# EAGLE design wing-driver (EAGLE 5.04)

## Sheet 1 of 2
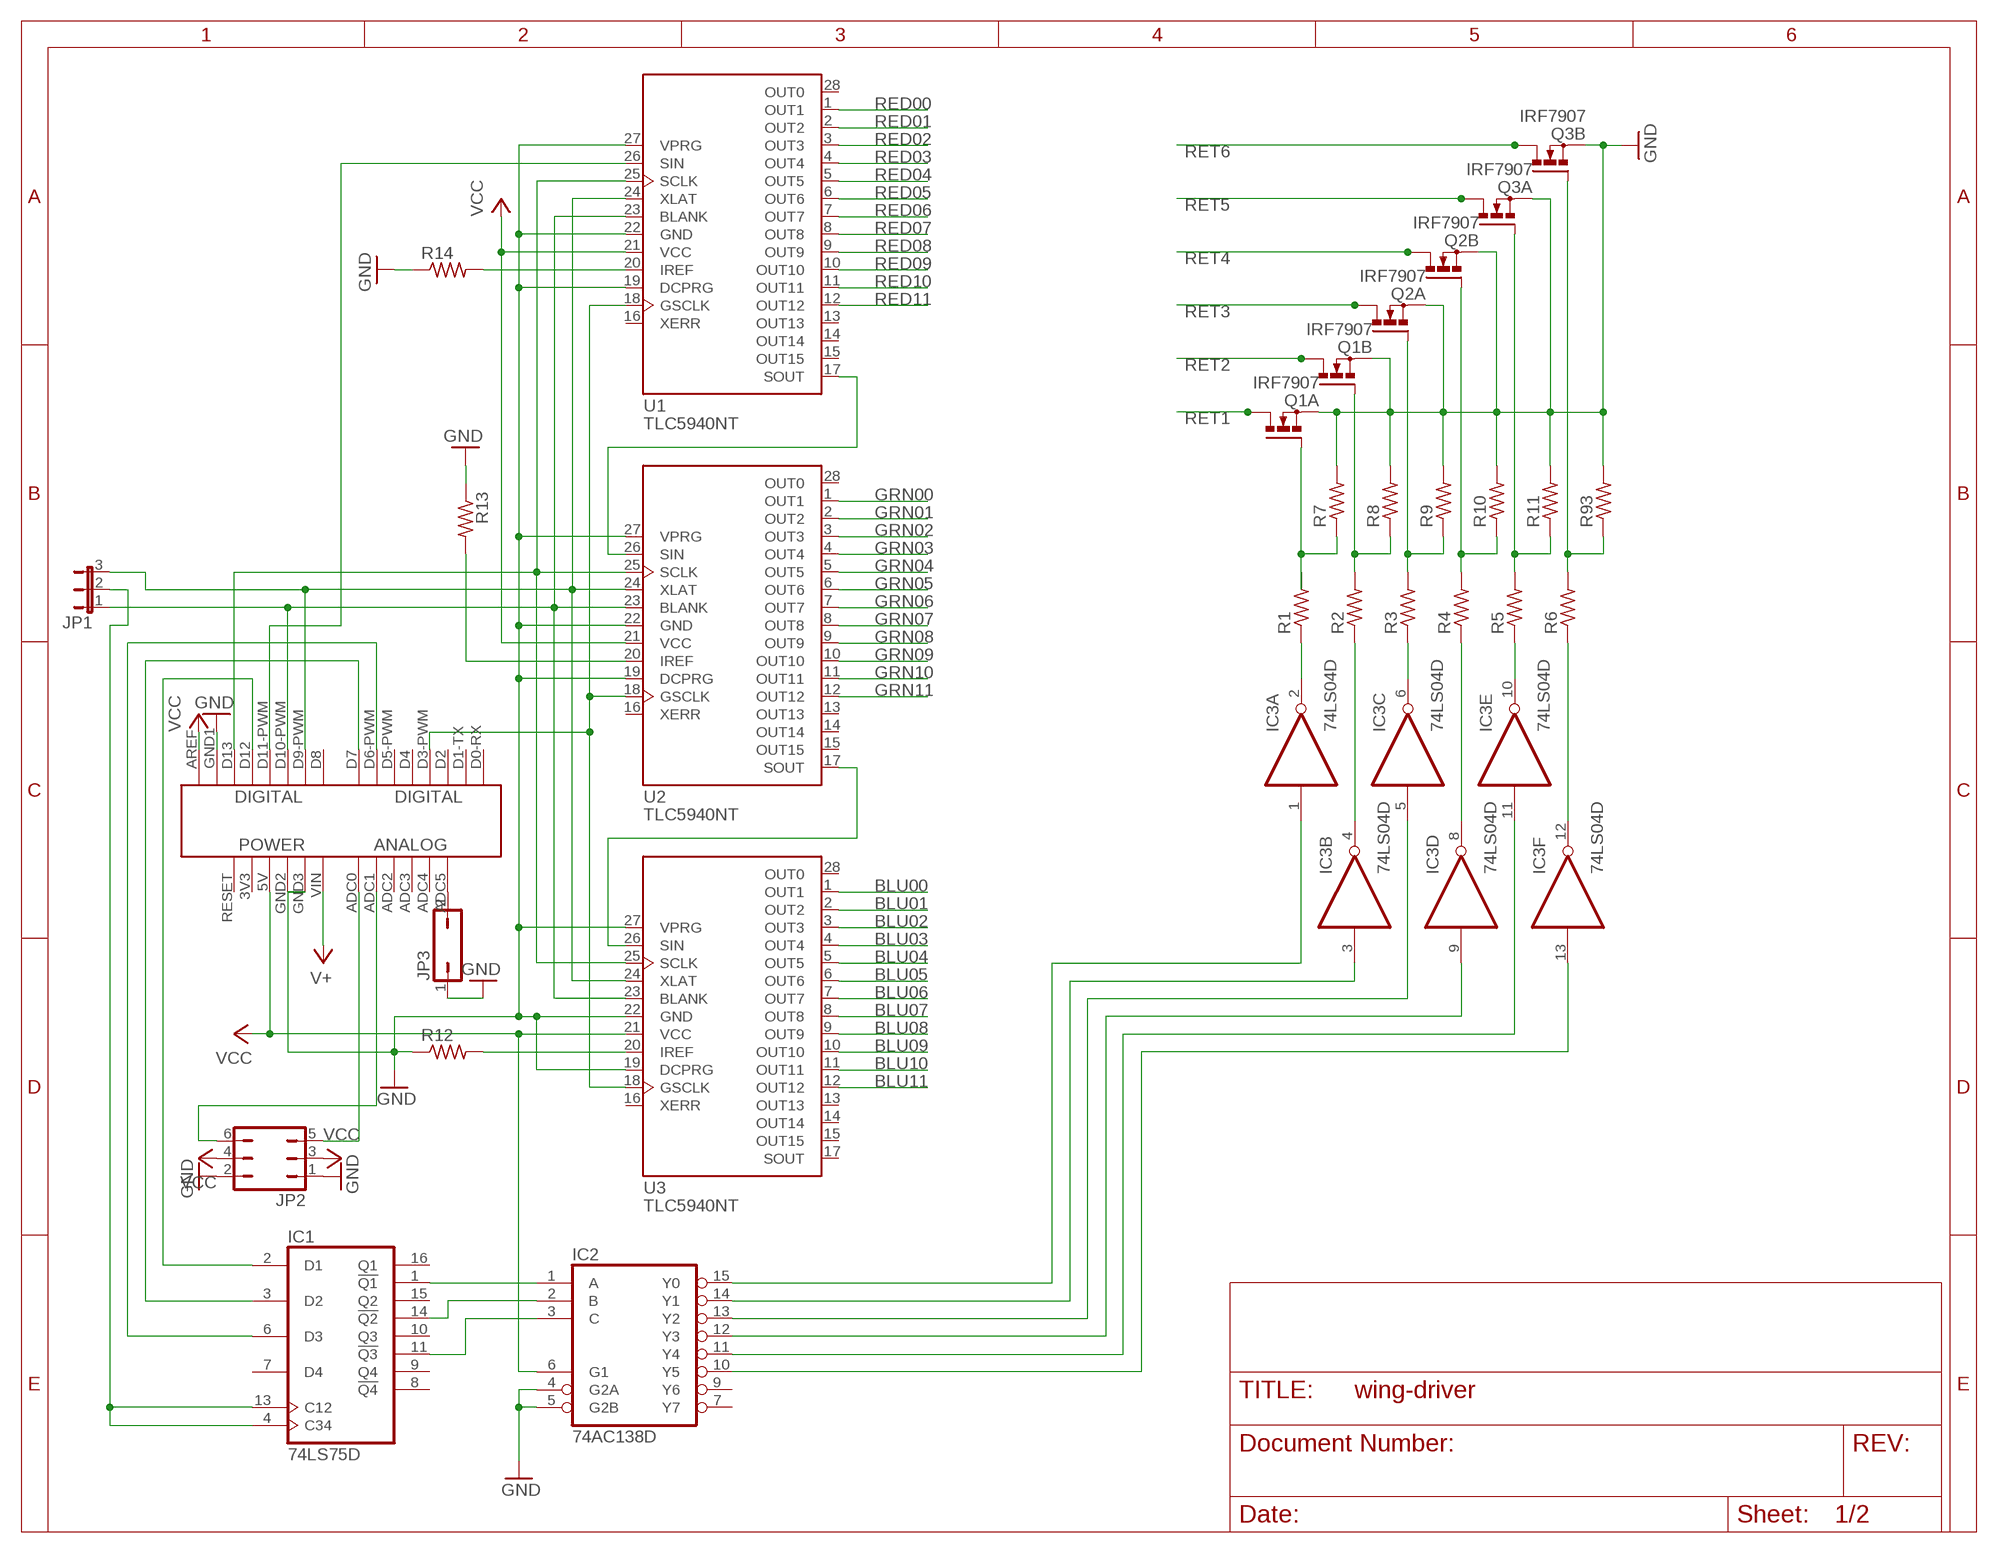
[diagram p0: schematic, sheet 1]

### Parts
IC1  74LS75D  [SO16]
IC2  74AC138D  [SO16]
IC3  74LS04D  [SO14]
JP1  JP2E  [JP2]
JP2  JP3Q  [JP3Q]
JP3  JP1Q  [JP1]
Q1  IRF7907  [SO8]
Q2  IRF7907  [SO8]
Q3  IRF7907  [SO8]
R1  R-US_R0603  [R0603]
R2  R-US_R0603  [R0603]
R3  R-US_R0603  [R0603]
R4  R-US_R0603  [R0603]
R5  R-US_R0603  [R0603]
R6  R-US_R0603  [R0603]
R7  R-US_R0603  [R0603]
R8  R-US_R0603  [R0603]
R9  R-US_R0603  [R0603]
R10  R-US_R0603  [R0603]
R11  R-US_R0603  [R0603]
R12  R-US_R0603  [R0603]
R13  R-US_R0603  [R0603]
R14  R-US_R0603  [R0603]
R93  R-US_R0603  [R0603]
SHIELD2  2009  [2009]
U1  TLC5940NT  [DIL28-3]
U2  TLC5940NT  [DIL28-3]
U3  TLC5940NT  [DIL28-3]

### Nets
BLU00: U3.1(OUT1) ; also sheet 2
BLU01: U3.2(OUT2) ; also sheet 2
BLU02: U3.3(OUT3) ; also sheet 2
BLU03: U3.4(OUT4) ; also sheet 2
BLU04: U3.5(OUT5) ; also sheet 2
BLU05: U3.6(OUT6) ; also sheet 2
BLU06: U3.7(OUT7) ; also sheet 2
BLU07: U3.8(OUT8) ; also sheet 2
BLU08: U3.9(OUT9) ; also sheet 2
BLU09: U3.10(OUT10) ; also sheet 2
BLU10: U3.11(OUT11) ; also sheet 2
BLU11: U3.12(OUT12) ; also sheet 2
GND: IC2.4(G2A) IC2.5(G2B) JP2.1 JP2.2 JP3.1 Q1.1(B:S) Q1.3(A:S) Q2.1(B:S) Q2.3(A:S) Q3.1(B:S) Q3.3(A:S) R7.2 R8.2 R9.2 R10.2 R11.2 R12.1 R13.1 R14.1 R93.2 SHIELD2.GND1 SHIELD2.GND2 SHIELD2.GND3 U1.19(DCPRG) U1.22(GND) U1.27(VPRG) U2.19(DCPRG) U2.22(GND) U2.27(VPRG) U3.19(DCPRG) U3.22(GND) U3.27(VPRG) ; also sheet 2
GRN00: U2.1(OUT1) ; also sheet 2
GRN01: U2.2(OUT2) ; also sheet 2
GRN02: U2.3(OUT3) ; also sheet 2
GRN03: U2.4(OUT4) ; also sheet 2
GRN04: U2.5(OUT5) ; also sheet 2
GRN05: U2.6(OUT6) ; also sheet 2
GRN06: U2.7(OUT7) ; also sheet 2
GRN07: U2.8(OUT8) ; also sheet 2
GRN08: U2.9(OUT9) ; also sheet 2
GRN09: U2.10(OUT10) ; also sheet 2
GRN10: U2.11(OUT11) ; also sheet 2
GRN11: U2.12(OUT12) ; also sheet 2
N$1: IC1.1(!Q1) IC2.1(A)
N$2: IC1.14(!Q2) IC2.2(B)
N$3: IC1.11(!Q3) IC2.3(C)
N$4: U1.17(SOUT) U2.26(SIN)
N$5: U2.17(SOUT) U3.26(SIN)
N$6: SHIELD2.D3-PWM(D3) U1.18(GSCLK) U2.18(GSCLK) U3.18(GSCLK)
N$8: JP1.1 SHIELD2.D10-PWM(D10) U1.23(BLANK) U2.23(BLANK) U3.23(BLANK)
N$9: SHIELD2.D11-PWM(D11) U1.26(SIN)
N$10: SHIELD2.D13 U1.25(SCLK) U2.25(SCLK) U3.25(SCLK)
N$11: IC1.4(C34) IC1.13(C12) JP1.2
N$12: IC1.2(D1) SHIELD2.D12
N$13: IC1.3(D2) SHIELD2.D7
N$14: JP1.3 SHIELD2.D9-PWM(D9) U1.24(XLAT) U2.24(XLAT) U3.24(XLAT)
N$15: IC2.15(Y0) IC3.1(A:I)
N$16: IC2.14(Y1) IC3.3(B:I)
N$17: IC2.13(Y2) IC3.5(C:I)
N$18: IC2.12(Y3) IC3.9(D:I)
N$19: IC2.11(Y4) IC3.11(E:I)
N$20: IC2.10(Y5) IC3.13(F:I)
N$21: Q1.4(A:G) R1.2 R7.1
N$22: Q1.2(B:G) R2.2 R8.1
N$23: Q2.4(A:G) R3.2 R9.1
N$24: Q2.2(B:G) R4.2 R10.1
N$25: Q3.4(A:G) R5.2 R11.1
N$26: Q3.2(B:G) R6.2 R93.1
N$28: R12.2 U3.20(IREF)
N$29: R13.2 U2.20(IREF)
N$30: IC3.2(A:O) R1.1
N$31: IC3.4(B:O) R2.1
N$32: IC3.6(C:O) R3.1
N$33: IC3.8(D:O) R4.1
N$34: IC3.10(E:O) R5.1
N$35: IC3.12(F:O) R6.1
N$36: R14.2 U1.20(IREF)
N$107: JP2.5 SHIELD2.ADC0
N$108: JP2.6 SHIELD2.ADC1
N$109: JP3.2 SHIELD2.ADC5
N$145: IC1.6(D3) SHIELD2.D6-PWM(D6)
RED00: U1.1(OUT1) ; also sheet 2
RED01: U1.2(OUT2) ; also sheet 2
RED02: U1.3(OUT3) ; also sheet 2
RED03: U1.4(OUT4) ; also sheet 2
RED04: U1.5(OUT5) ; also sheet 2
RED05: U1.6(OUT6) ; also sheet 2
RED06: U1.7(OUT7) ; also sheet 2
RED07: U1.8(OUT8) ; also sheet 2
RED08: U1.9(OUT9) ; also sheet 2
RED09: U1.10(OUT10) ; also sheet 2
RED10: U1.11(OUT11) ; also sheet 2
RED11: U1.12(OUT12) ; also sheet 2
RET1: Q1.5(A:D) Q1.6(A:D) ; also sheet 2
RET2: Q1.7(B:D) Q1.8(B:D) ; also sheet 2
RET3: Q2.5(A:D) Q2.6(A:D) ; also sheet 2
RET4: Q2.7(B:D) Q2.8(B:D) ; also sheet 2
RET5: Q3.5(A:D) Q3.6(A:D) ; also sheet 2
RET6: Q3.7(B:D) Q3.8(B:D) ; also sheet 2
VCC: IC2.6(G1) JP2.3 JP2.4 SHIELD2.5V SHIELD2.AREF U1.21(VCC) U2.21(VCC) U3.21(VCC)
VIN: SHIELD2.VIN ; supply symbol labelled V+ ; also sheet 2
Unconnected: IC1.7(D4) IC1.8(!Q4) IC1.9(Q4) IC1.10(Q3) IC1.15(Q2) IC1.16(Q1) IC2.7(Y7) IC2.9(Y6) SHIELD2.3V3 SHIELD2.ADC2 SHIELD2.ADC3 SHIELD2.ADC4 SHIELD2.D0-RX(D0) SHIELD2.D1-TX(D1) SHIELD2.D2 SHIELD2.D4 SHIELD2.D5-PWM(D5) SHIELD2.D8 SHIELD2.RESET U1.13(OUT13) U1.14(OUT14) U1.15(OUT15) U1.16(XERR) U1.28(OUT0) U2.13(OUT13) U2.14(OUT14) U2.15(OUT15) U2.16(XERR) U2.28(OUT0) U3.13(OUT13) U3.14(OUT14) U3.15(OUT15) U3.16(XERR) U3.17(SOUT) U3.28(OUT0)

## Sheet 2 of 2
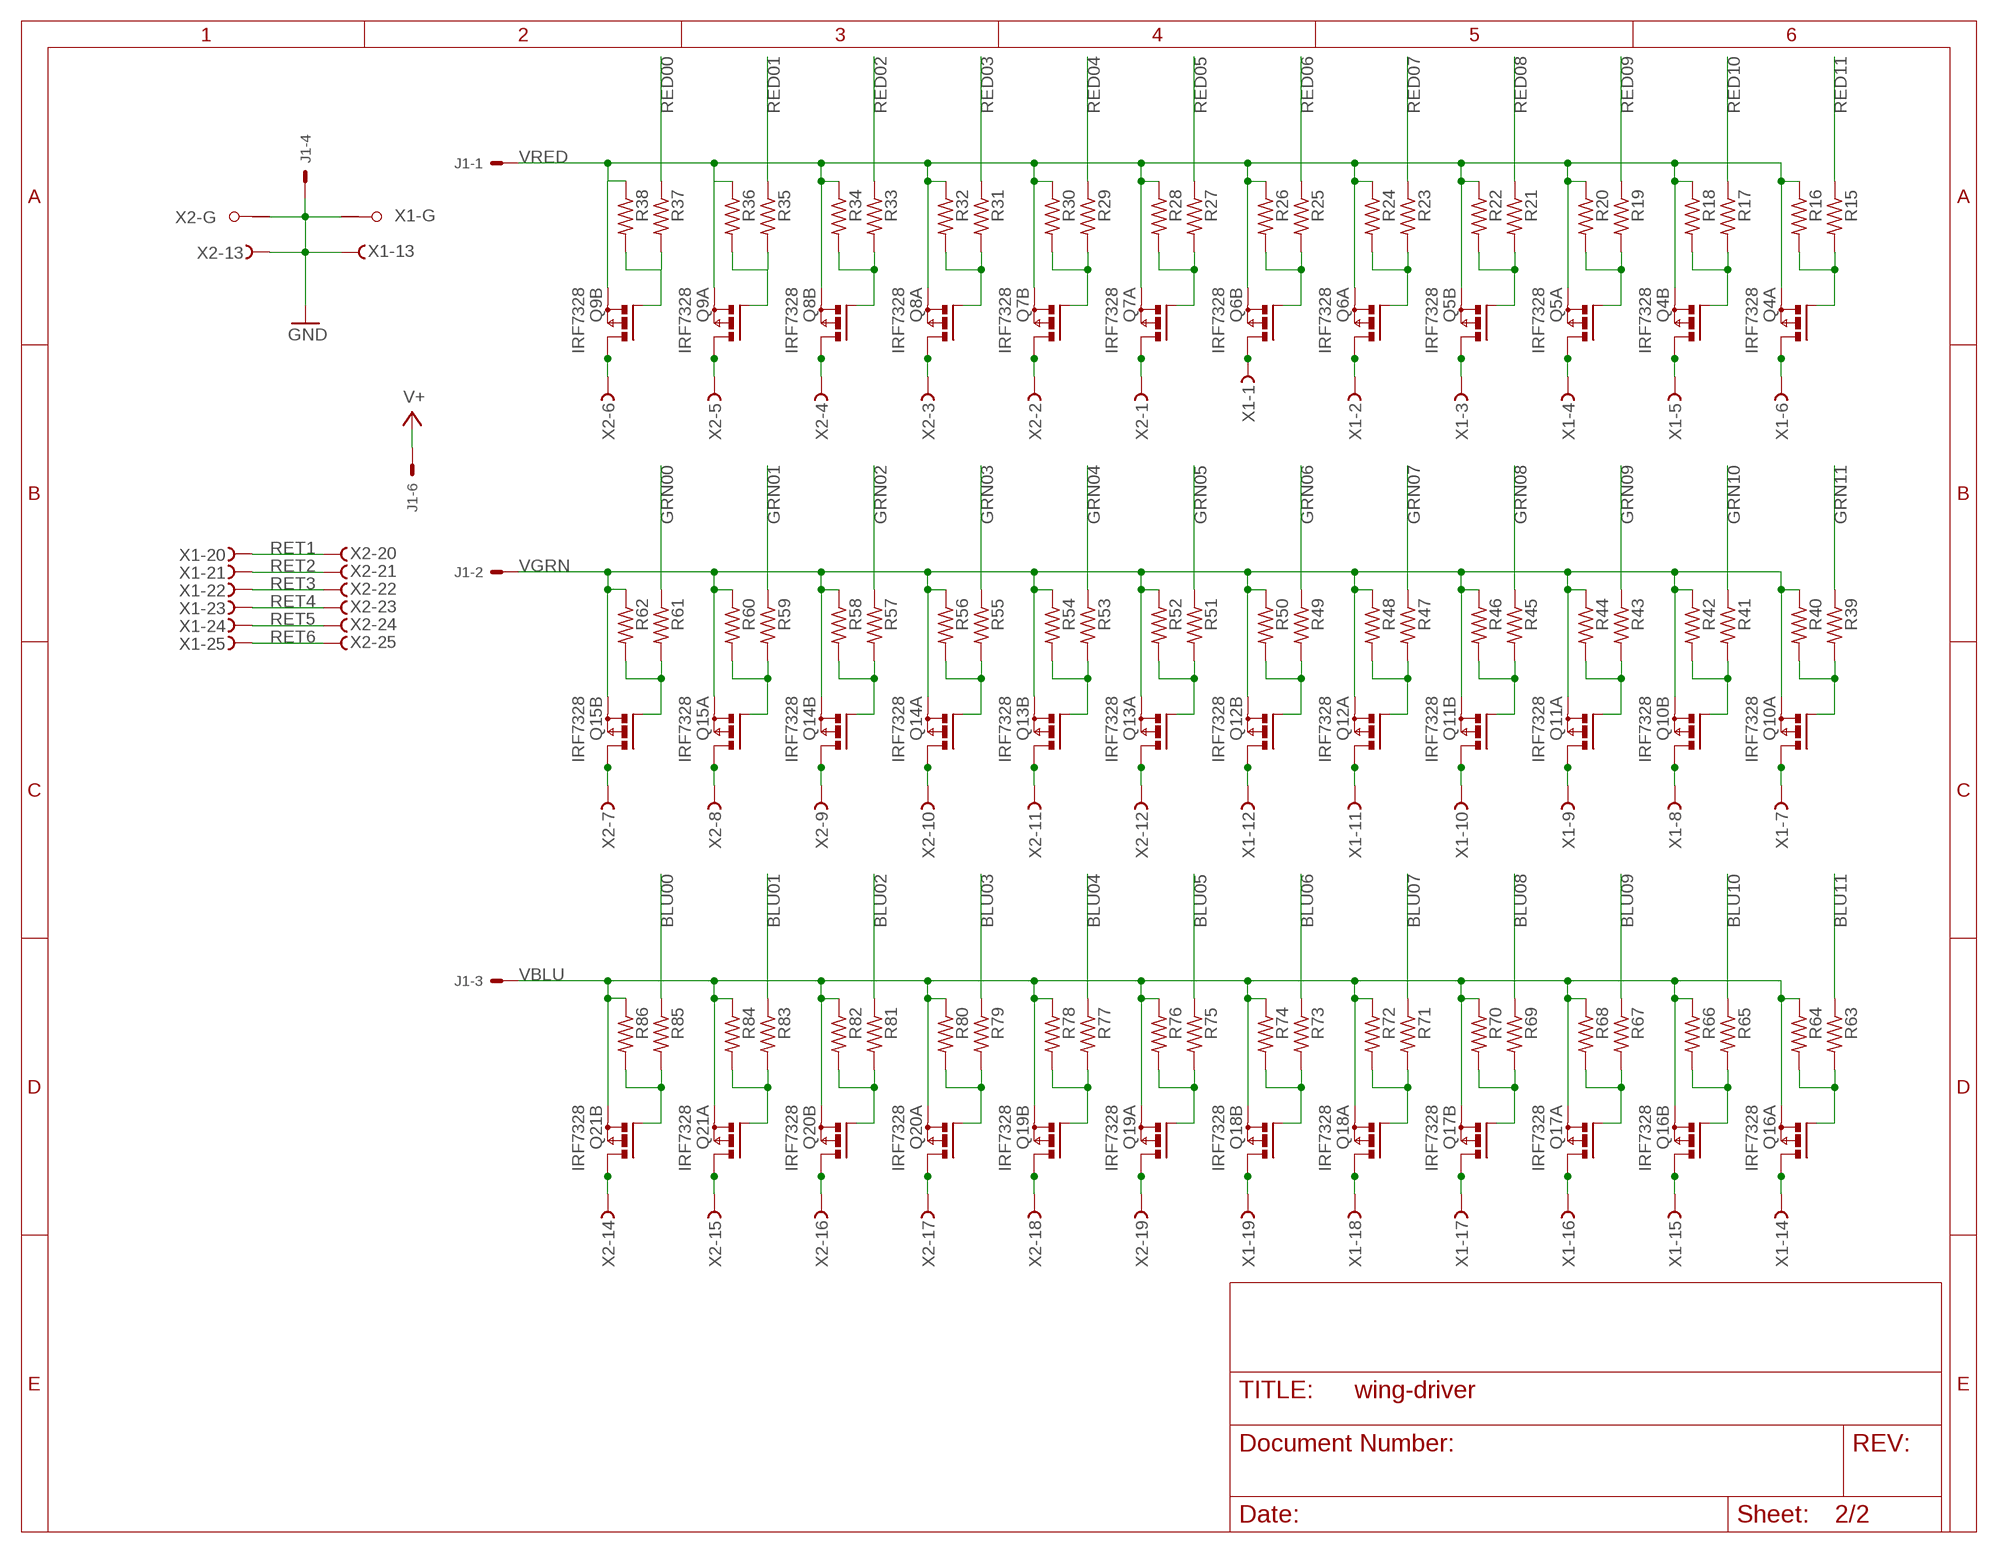
[diagram p1: schematic, sheet 2]

### Parts
J1  5569-08A2  [5569-08A2]
Q4  IRF7328  [SO8]
Q5  IRF7328  [SO8]
Q6  IRF7328  [SO8]
Q7  IRF7328  [SO8]
Q8  IRF7328  [SO8]
Q9  IRF7328  [SO8]
Q10  IRF7328  [SO8]
Q11  IRF7328  [SO8]
Q12  IRF7328  [SO8]
Q13  IRF7328  [SO8]
Q14  IRF7328  [SO8]
Q15  IRF7328  [SO8]
Q16  IRF7328  [SO8]
Q17  IRF7328  [SO8]
Q18  IRF7328  [SO8]
Q19  IRF7328  [SO8]
Q20  IRF7328  [SO8]
Q21  IRF7328  [SO8]
R15  R-US_R0603  [R0603]
R16  R-US_R0603  [R0603]
R17  R-US_R0603  [R0603]
R18  R-US_R0603  [R0603]
R19  R-US_R0603  [R0603]
R20  R-US_R0603  [R0603]
R21  R-US_R0603  [R0603]
R22  R-US_R0603  [R0603]
R23  R-US_R0603  [R0603]
R24  R-US_R0603  [R0603]
R25  R-US_R0603  [R0603]
R26  R-US_R0603  [R0603]
R27  R-US_R0603  [R0603]
R28  R-US_R0603  [R0603]
R29  R-US_R0603  [R0603]
R30  R-US_R0603  [R0603]
R31  R-US_R0603  [R0603]
R32  R-US_R0603  [R0603]
R33  R-US_R0603  [R0603]
R34  R-US_R0603  [R0603]
R35  R-US_R0603  [R0603]
R36  R-US_R0603  [R0603]
R37  R-US_R0603  [R0603]
R38  R-US_R0603  [R0603]
R39  R-US_R0603  [R0603]
R40  R-US_R0603  [R0603]
R41  R-US_R0603  [R0603]
R42  R-US_R0603  [R0603]
R43  R-US_R0603  [R0603]
R44  R-US_R0603  [R0603]
R45  R-US_R0603  [R0603]
R46  R-US_R0603  [R0603]
R47  R-US_R0603  [R0603]
R48  R-US_R0603  [R0603]
R49  R-US_R0603  [R0603]
R50  R-US_R0603  [R0603]
R51  R-US_R0603  [R0603]
R52  R-US_R0603  [R0603]
R53  R-US_R0603  [R0603]
R54  R-US_R0603  [R0603]
R55  R-US_R0603  [R0603]
R56  R-US_R0603  [R0603]
R57  R-US_R0603  [R0603]
R58  R-US_R0603  [R0603]
R59  R-US_R0603  [R0603]
R60  R-US_R0603  [R0603]
R61  R-US_R0603  [R0603]
R62  R-US_R0603  [R0603]
R63  R-US_R0603  [R0603]
R64  R-US_R0603  [R0603]
R65  R-US_R0603  [R0603]
R66  R-US_R0603  [R0603]
R67  R-US_R0603  [R0603]
R68  R-US_R0603  [R0603]
R69  R-US_R0603  [R0603]
R70  R-US_R0603  [R0603]
R71  R-US_R0603  [R0603]
R72  R-US_R0603  [R0603]
R73  R-US_R0603  [R0603]
R74  R-US_R0603  [R0603]
R75  R-US_R0603  [R0603]
R76  R-US_R0603  [R0603]
R77  R-US_R0603  [R0603]
R78  R-US_R0603  [R0603]
R79  R-US_R0603  [R0603]
R80  R-US_R0603  [R0603]
R81  R-US_R0603  [R0603]
R82  R-US_R0603  [R0603]
R83  R-US_R0603  [R0603]
R84  R-US_R0603  [R0603]
R85  R-US_R0603  [R0603]
R86  R-US_R0603  [R0603]
X1  F25VPS  [F25VP]
X2  F25VPS  [F25VP]

### Nets
BLU00: R85.1 ; also sheet 1
BLU01: R83.1 ; also sheet 1
BLU02: R81.1 ; also sheet 1
BLU03: R79.1 ; also sheet 1
BLU04: R77.1 ; also sheet 1
BLU05: R75.1 ; also sheet 1
BLU06: R73.1 ; also sheet 1
BLU07: R71.1 ; also sheet 1
BLU08: R69.1 ; also sheet 1
BLU09: R67.1 ; also sheet 1
BLU10: R65.1 ; also sheet 1
BLU11: R63.1 ; also sheet 1
GND: J1.4 X1.13(-13:F) X1.G1(-G:G1) X2.13(-13:F) X2.G1(-G:G1) ; also sheet 1
GRN00: R61.1 ; also sheet 1
GRN01: R59.1 ; also sheet 1
GRN02: R57.1 ; also sheet 1
GRN03: R55.1 ; also sheet 1
GRN04: R53.1 ; also sheet 1
GRN05: R51.1 ; also sheet 1
GRN06: R49.1 ; also sheet 1
GRN07: R47.1 ; also sheet 1
GRN08: R45.1 ; also sheet 1
GRN09: R43.1 ; also sheet 1
GRN10: R41.1 ; also sheet 1
GRN11: R39.1 ; also sheet 1
N$7: Q9.7(A:D) Q9.8(A:D) X2.5(-5:F)
N$27: Q4.2(A:G) R15.2 R16.2
N$37: Q6.4(B:G) R25.2 R26.2
N$38: Q4.4(B:G) R17.2 R18.2
N$39: Q7.2(A:G) R27.2 R28.2
N$40: Q8.2(A:G) R31.2 R32.2
N$41: Q7.4(B:G) R29.2 R30.2
N$42: Q5.4(B:G) R21.2 R22.2
N$43: Q5.2(A:G) R19.2 R20.2
N$44: Q6.2(A:G) R23.2 R24.2
N$45: Q8.4(B:G) R33.2 R34.2
N$46: Q9.2(A:G) R35.2 R36.2
N$47: Q9.4(B:G) R37.2 R38.2
N$48: Q9.5(B:D) Q9.6(B:D) X2.6(-6:F)
N$49: Q8.5(B:D) Q8.6(B:D) X2.4(-4:F)
N$50: Q8.7(A:D) Q8.8(A:D) X2.3(-3:F)
N$51: Q7.7(A:D) Q7.8(A:D) X2.1(-1:F)
N$52: Q6.7(A:D) Q6.8(A:D) X1.2(-2:F)
N$53: Q7.5(B:D) Q7.6(B:D) X2.2(-2:F)
N$54: Q6.5(B:D) Q6.6(B:D) X1.1(-1:F)
N$55: Q5.5(B:D) Q5.6(B:D) X1.3(-3:F)
N$56: Q5.7(A:D) Q5.8(A:D) X1.4(-4:F)
N$57: Q4.5(B:D) Q4.6(B:D) X1.5(-5:F)
N$58: Q4.7(A:D) Q4.8(A:D) X1.6(-6:F)
N$59: Q10.2(A:G) R39.2 R40.2
N$60: Q10.4(B:G) R41.2 R42.2
N$61: Q11.4(B:G) R45.2 R46.2
N$62: Q11.2(A:G) R43.2 R44.2
N$63: Q12.2(A:G) R47.2 R48.2
N$64: Q12.4(B:G) R49.2 R50.2
N$65: Q13.2(A:G) R51.2 R52.2
N$66: Q14.2(A:G) R55.2 R56.2
N$67: Q13.4(B:G) R53.2 R54.2
N$68: Q14.4(B:G) R57.2 R58.2
N$69: Q15.2(A:G) R59.2 R60.2
N$70: Q15.4(B:G) R61.2 R62.2
N$71: Q15.7(A:D) Q15.8(A:D) X2.8(-8:F)
N$72: Q15.5(B:D) Q15.6(B:D) X2.7(-7:F)
N$73: Q14.5(B:D) Q14.6(B:D) X2.9(-9:F)
N$74: Q14.7(A:D) Q14.8(A:D) X2.10(-10:F)
N$75: Q13.7(A:D) Q13.8(A:D) X2.12(-12:F)
N$76: Q12.7(A:D) Q12.8(A:D) X1.11(-11:F)
N$77: Q13.5(B:D) Q13.6(B:D) X2.11(-11:F)
N$78: Q12.5(B:D) Q12.6(B:D) X1.12(-12:F)
N$79: Q11.5(B:D) Q11.6(B:D) X1.10(-10:F)
N$80: Q11.7(A:D) Q11.8(A:D) X1.9(-9:F)
N$81: Q10.5(B:D) Q10.6(B:D) X1.8(-8:F)
N$82: Q10.7(A:D) Q10.8(A:D) X1.7(-7:F)
N$83: Q16.2(A:G) R63.2 R64.2
N$84: Q16.4(B:G) R65.2 R66.2
N$85: Q17.4(B:G) R69.2 R70.2
N$86: Q17.2(A:G) R67.2 R68.2
N$87: Q18.2(A:G) R71.2 R72.2
N$88: Q18.4(B:G) R73.2 R74.2
N$89: Q19.2(A:G) R75.2 R76.2
N$90: Q20.2(A:G) R79.2 R80.2
N$91: Q19.4(B:G) R77.2 R78.2
N$92: Q20.4(B:G) R81.2 R82.2
N$93: Q21.2(A:G) R83.2 R84.2
N$94: Q21.4(B:G) R85.2 R86.2
N$95: Q21.7(A:D) Q21.8(A:D) X2.15(-15:F)
N$96: Q21.5(B:D) Q21.6(B:D) X2.14(-14:F)
N$97: Q20.5(B:D) Q20.6(B:D) X2.16(-16:F)
N$98: Q20.7(A:D) Q20.8(A:D) X2.17(-17:F)
N$99: Q19.7(A:D) Q19.8(A:D) X2.19(-19:F)
N$100: Q18.7(A:D) Q18.8(A:D) X1.18(-18:F)
N$101: Q19.5(B:D) Q19.6(B:D) X2.18(-18:F)
N$102: Q18.5(B:D) Q18.6(B:D) X1.19(-19:F)
N$103: Q17.5(B:D) Q17.6(B:D) X1.17(-17:F)
N$104: Q17.7(A:D) Q17.8(A:D) X1.16(-16:F)
N$105: Q16.5(B:D) Q16.6(B:D) X1.15(-15:F)
N$106: Q16.7(A:D) Q16.8(A:D) X1.14(-14:F)
RED00: R37.1 ; also sheet 1
RED01: R35.1 ; also sheet 1
RED02: R33.1 ; also sheet 1
RED03: R31.1 ; also sheet 1
RED04: R29.1 ; also sheet 1
RED05: R27.1 ; also sheet 1
RED06: R25.1 ; also sheet 1
RED07: R23.1 ; also sheet 1
RED08: R21.1 ; also sheet 1
RED09: R19.1 ; also sheet 1
RED10: R17.1 ; also sheet 1
RED11: R15.1 ; also sheet 1
RET1: X1.20(-20:F) X2.20(-20:F) ; also sheet 1
RET2: X1.21(-21:F) X2.21(-21:F) ; also sheet 1
RET3: X1.22(-22:F) X2.22(-22:F) ; also sheet 1
RET4: X1.23(-23:F) X2.23(-23:F) ; also sheet 1
RET5: X1.24(-24:F) X2.24(-24:F) ; also sheet 1
RET6: X1.25(-25:F) X2.25(-25:F) ; also sheet 1
VBLU: J1.3 Q16.1(A:S) Q16.3(B:S) Q17.1(A:S) Q17.3(B:S) Q18.1(A:S) Q18.3(B:S) Q19.1(A:S) Q19.3(B:S) Q20.1(A:S) Q20.3(B:S) Q21.1(A:S) Q21.3(B:S) R64.1 R66.1 R68.1 R70.1 R72.1 R74.1 R76.1 R78.1 R80.1 R82.1 R84.1 R86.1
VGRN: J1.2 Q10.1(A:S) Q10.3(B:S) Q11.1(A:S) Q11.3(B:S) Q12.1(A:S) Q12.3(B:S) Q13.1(A:S) Q13.3(B:S) Q14.1(A:S) Q14.3(B:S) Q15.1(A:S) Q15.3(B:S) R40.1 R42.1 R44.1 R46.1 R48.1 R50.1 R52.1 R54.1 R56.1 R58.1 R60.1 R62.1
VIN: J1.6 ; supply symbol labelled V+ ; also sheet 1
VRED: J1.1 Q4.1(A:S) Q4.3(B:S) Q5.1(A:S) Q5.3(B:S) Q6.1(A:S) Q6.3(B:S) Q7.1(A:S) Q7.3(B:S) Q8.1(A:S) Q8.3(B:S) Q9.1(A:S) Q9.3(B:S) R16.1 R18.1 R20.1 R22.1 R24.1 R26.1 R28.1 R30.1 R32.1 R34.1 R36.1 R38.1
Unconnected: J1.5 J1.7 J1.8 X1.G2(-G:G2) X2.G2(-G:G2)

## Power pins joined to a net without a drawn wire
GND: IC1.12(GND) IC2.8(GND) IC3.7(P:GND)
VCC: IC1.5(VCC) IC2.16(VCC) IC3.14(P:VCC)

## Library data of the parts
IC1 = 74xx-us:74*75: 4-bit bistable LATCH
IC2 = 74xx-eu:74*138: 3-line to 8-line DECODER/DEMULTIPLEXER
IC3 = 74xx-us:74*04: Hex INVERTER
J1 = molex-minifitjr:5569-08A2
JP1 = jumper:JP2E: JUMPER
JP2 = jumper:JP3Q: JUMPER
JP3 = jumper:JP1Q: JUMPER
Q1-Q3 = irf-so8:IRF7907
Q4-Q21 = irf-so8:IRF7328
R1-R86 R93 = resistor:R-US_: RESISTOR, American symbol
SHIELD2 = arduino-shields:2009
U1-U3 = ti-stuff:TLC5940
X1 X2 = con-subd:F25VPS: SUB-D

## Board
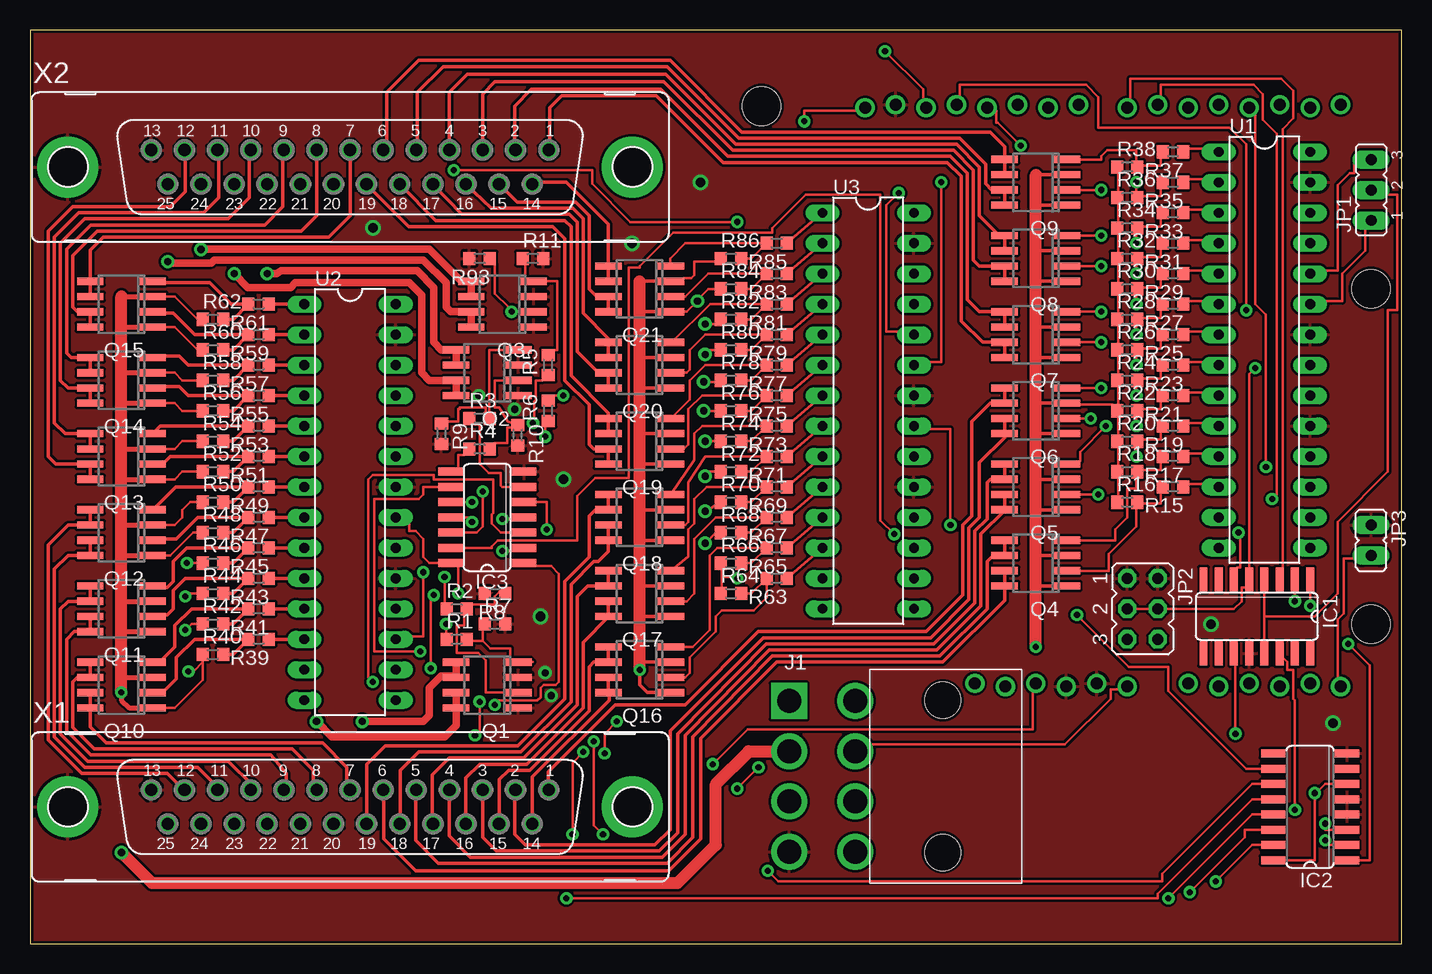
[diagram p2: board, top side]
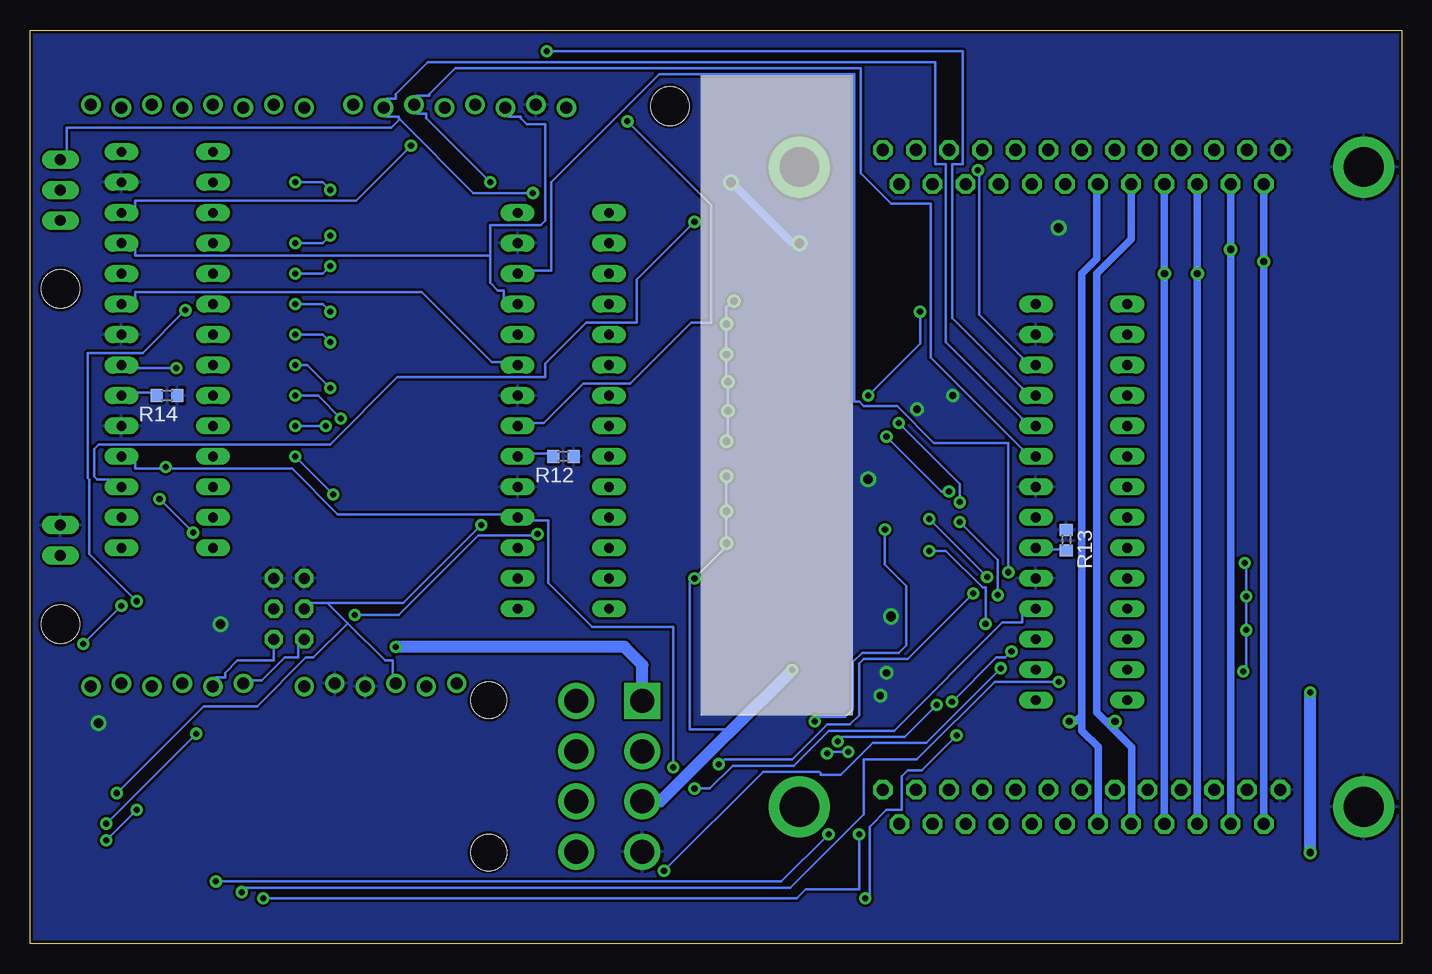
[diagram p3: board, bottom side, seen from below]

Size 114.3 x 76.2 mm. Coordinates in mm from the lower left corner, seen from the top.
Outline: 0,0 114.3,0 114.3,76.2 0,76.2 0,0
Copper layers (1*16): Top 0.035mm / dielectric 1.5mm / Bottom 0.035mm
Design rules "SparkFun": minimum track width 8mil, minimum drill 20mil, track to track 8mil, track to pad 8mil, pad to pad 8mil, via to via 8mil, smd to smd 8mil, copper to edge 10mil, drill to drill 8mil, minimum pad ring 12mil, minimum via ring 10mil, stop-mask expansion 4mil, vias tented up to drill 25mil, thermal gap 10mil

### Footprints (pad centres in the part's own frame; a part is rotated, then mirrored left to right if it is on the bottom)
SO16 = smd 0.66 x 2.032: 1 -4.445,-3.073; 2 -3.175,-3.073; 3 -1.905,-3.073; 4 -0.635,-3.073; 5 0.635,-3.073; 6 1.905,-3.073; 7 3.175,-3.073; 8 4.445,-3.073; 9 4.445,3.073; 10 3.175,3.073; 11 1.905,3.073; 12 0.635,3.073; 13 -0.635,3.073; 14 -1.905,3.073; 15 -3.175,3.073; 16 -4.445,3.073
SO14 = smd 0.66 x 2.032: 1 -3.81,-3.073; 2 -2.54,-3.073; 3 -1.27,-3.073; 4 0,-3.073; 5 1.27,-3.073; 6 2.54,-3.073; 7 3.81,-3.073; 8 3.81,3.073; 9 2.54,3.073; 10 1.27,3.073; 11 0,3.073; 12 -1.27,3.073; 13 -2.54,3.073; 14 -3.81,3.073
5569-08A2 = drill 2 square: 1 -3.416,6.287 | drill 2 round: 2 -3.416,2.095; 3 -3.416,-2.095; 4 -3.416,-6.287; 5 2.095,6.287; 6 2.095,2.095; 7 2.095,-2.095; 8 2.095,-6.287 | hole 2.997: 9.385,6.35; 9.385,-6.35
JP2 = drill 0.914 long: 1 -2.54,0; 2 0,0; 3 2.54,0
JP3Q = drill 0.914 octagon: 1 -2.54,-1.27; 2 -2.54,1.27; 3 0,-1.27; 4 0,1.27; 5 2.54,-1.27; 6 2.54,1.27
JP1 = drill 0.914 long: 1 0,-1.27; 2 0,1.27
SO8 = smd 0.6 x 2.2: 1 -1.905,-2.6; 2 -0.635,-2.6; 3 0.635,-2.6; 4 1.905,-2.6; 5 1.905,2.6; 6 0.635,2.6; 7 -0.635,2.6; 8 -1.905,2.6
R0603 = smd 1 x 1.1: 1 -0.85,0; 2 0.85,0
2009 = drill 1 round: 3V3 35.56,2.413; 5V 38.1,2.667; ADC0 50.8,2.667; ADC1 53.34,2.413; ADC2 55.88,2.667; ADC3 58.42,2.413; ADC4 60.96,2.667; ADC5 63.5,2.413; AREF 23.876,50.673; D0-RX 63.5,50.927; D1-TX 60.96,50.673; D2 58.42,50.927; D3-PWM 55.88,50.673; D4 53.34,50.927; D5-PWM 50.8,50.673; D6-PWM 48.26,50.927; D7 45.72,50.673; D8 41.656,50.927; D9-PWM 39.116,50.673; D10-PWM 36.576,50.927; D11-PWM 34.036,50.673; D12 31.496,50.927; D13 28.956,50.673; GND1 26.416,50.927; GND2 40.64,2.413; GND3 43.18,2.667; RESET 33.02,2.667; VIN 45.72,2.413 | hole 3.2: 15.24,50.8; 66.04,35.56; 66.04,7.62
DIL28-3 = drill 0.813 long: 1 -16.51,-3.81; 2 -13.97,-3.81; 3 -11.43,-3.81; 4 -8.89,-3.81; 5 -6.35,-3.81; 6 -3.81,-3.81; 7 -1.27,-3.81; 8 1.27,-3.81; 9 3.81,-3.81; 10 6.35,-3.81; 11 8.89,-3.81; 12 11.43,-3.81; 13 13.97,-3.81; 14 16.51,-3.81; 15 16.51,3.81; 16 13.97,3.81; 17 11.43,3.81; 18 8.89,3.81; 19 6.35,3.81; 20 3.81,3.81; 21 1.27,3.81; 22 -1.27,3.81; 23 -3.81,3.81; 24 -6.35,3.81; 25 -8.89,3.81; 26 -11.43,3.81; 27 -13.97,3.81; 28 -16.51,3.81
F25VP = drill 1.016 octagon: 1 16.561,1.422; 2 13.792,1.422; 3 11.049,1.422; 4 8.28,1.422; 5 5.512,1.422; 6 2.769,1.422; 7 0,1.422; 8 -2.769,1.422; 9 -5.512,1.422; 10 -8.28,1.422; 11 -11.049,1.422; 12 -13.792,1.422; 13 -16.561,1.422; 14 15.189,-1.422; 15 12.421,-1.422; 16 9.652,-1.422; 17 6.909,-1.422; 18 4.14,-1.422; 19 1.372,-1.422; 20 -1.372,-1.422; 21 -4.14,-1.422; 22 -6.909,-1.422; 23 -9.652,-1.422; 24 -12.421,-1.422; 25 -15.189,-1.422 | drill 3.302 pad 5.08 round: G1 -23.52,0; G2 23.52,0

### Placement (x,y rotation side)
IC1  102.23,27.3 180 top
IC2  106.68,11.43 90 top
IC3  38.1,35.56 90 top
J1  66.67,13.97 0 top
JP1  111.76,62.87 90 top
JP2  92.71,27.94 270 top
JP3  111.76,33.66 180 top
Q1  38.1,21.59 90 top
Q2  38.1,47.62 90 top
Q3  39.37,53.34 90 top
Q4  83.82,31.75 90 top
Q5  83.82,38.1 90 top
Q6  83.82,44.45 90 top
Q7  83.82,50.8 90 top
Q8  83.82,57.15 90 top
Q9  83.82,63.5 90 top
Q10  7.62,21.59 90 top
Q11  7.62,27.94 90 top
Q12  7.62,34.29 90 top
Q13  7.62,40.64 90 top
Q14  7.62,46.99 90 top
Q15  7.62,53.34 90 top
Q16  50.8,22.86 90 top
Q17  50.8,29.21 90 top
Q18  50.8,35.56 90 top
Q19  50.8,41.91 90 top
Q20  50.8,48.26 90 top
Q21  50.8,54.61 90 top
R1  35.56,25.4 0 top
R2  35.56,27.94 0 top
R3  37.47,43.81 0 top
R4  37.47,41.27 0 top
R5  43.18,48.26 90 top
R6  43.18,44.45 90 top
R7  38.73,26.67 0 top
R8  38.73,29.21 180 top
R9  34.29,42.55 270 top
R10  40.64,42.42 270 top
R11  41.91,57.15 0 top
R12  69.85,40.64 180 bottom
R13  27.94,33.66 270 bottom
R14  102.87,45.72 180 bottom
R15  95.25,38.1 180 top
R16  91.44,36.83 0 top
R17  95.25,40.64 180 top
R18  91.44,39.37 0 top
R19  95.25,43.18 180 top
R20  91.44,41.91 0 top
R21  95.25,45.72 180 top
R22  91.44,44.45 0 top
R23  95.25,48.26 180 top
R24  91.44,46.99 0 top
R25  95.25,50.8 180 top
R26  91.44,49.53 0 top
R27  95.25,53.34 180 top
R28  91.44,52.07 0 top
R29  95.25,55.88 180 top
R30  91.44,54.61 0 top
R31  95.25,58.42 180 top
R32  91.44,57.15 0 top
R33  95.25,60.96 180 top
R34  91.44,59.69 0 top
R35  95.25,63.5 180 top
R36  91.44,62.23 0 top
R37  95.25,66.04 180 top
R38  91.44,64.77 0 top
R39  19.05,25.4 180 top
R40  15.24,24.13 0 top
R41  19.05,27.94 180 top
R42  15.24,26.67 0 top
R43  19.05,30.48 180 top
R44  15.24,29.21 0 top
R45  19.05,33.02 180 top
R46  15.24,31.75 0 top
R47  19.05,35.56 180 top
R48  15.24,34.29 0 top
R49  19.05,38.1 180 top
R50  15.24,36.83 0 top
R51  19.05,40.64 180 top
R52  15.24,39.37 0 top
R53  19.05,43.18 180 top
R54  15.24,41.91 0 top
R55  19.05,45.72 180 top
R56  15.24,44.45 0 top
R57  19.05,48.26 180 top
R58  15.24,46.99 0 top
R59  19.05,50.8 180 top
R60  15.24,49.53 0 top
R61  19.05,53.34 180 top
R62  15.24,52.07 0 top
R63  62.23,30.48 180 top
R64  58.42,29.21 0 top
R65  62.23,33.02 180 top
R66  58.42,31.75 0 top
R67  62.23,35.56 180 top
R68  58.42,34.29 0 top
R69  62.23,38.1 180 top
R70  58.42,36.83 0 top
R71  62.23,40.64 180 top
R72  58.42,39.37 0 top
R73  62.23,43.18 180 top
R74  58.42,41.91 0 top
R75  62.23,45.72 180 top
R76  58.42,44.45 0 top
R77  62.23,48.26 180 top
R78  58.42,46.99 0 top
R79  62.23,50.8 180 top
R80  58.42,49.53 0 top
R81  62.23,53.34 180 top
R82  58.42,52.07 0 top
R83  62.23,55.88 180 top
R84  58.42,54.61 0 top
R85  62.23,58.42 180 top
R86  58.42,57.15 0 top
R93  37.47,57.15 180 top
SHIELD2  45.72,19.05 0 top
U1  102.87,49.53 270 top
U2  26.67,36.83 270 top
U3  69.85,44.45 270 top
X1  26.67,11.43 0 top
X2  26.67,64.77 0 top

### Tracks (layer width: path | path; a pad name or v marks a point on that pad's centre or on a via)
BLU00
  Top 0.203: R85.1 U3.1
BLU01
  Top 0.203: R83.1 U3.2
BLU02
  Top 0.203: R81.1 U3.3
BLU03
  Top 0.203: R79.1 U3.4
BLU04
  Top 0.203: R77.1 U3.5
BLU05
  Top 0.203: R75.1 U3.6
BLU06
  Top 0.203: R73.1 U3.7
BLU07
  Top 0.203: R71.1 U3.8
BLU08
  Top 0.203: R69.1 U3.9
BLU09
  Top 0.203: R67.1 U3.10
BLU10
  Top 0.203: R65.1 U3.11
BLU11
  Top 0.203: R63.1 U3.12
GND  (via drill 0.6, 0.8)
  Bottom 0.61: v50.16,58.42 50.8,58.42 v55.88,63.5
  other vias: 28.57,59.69 42.55,27.3 44.45,38.73 98.42,26.67 108.58,18.41 42.93,22.61 43.43,20.7 37.4,45.72 40.39,44.58
  pour Bottom: 0,76.2 114.3,76.2 114.3,0 0,0
  pour Top: 0,76.2 114.3,76.2 114.3,0 0,0
GRN00
  Top 0.305: R61.1 U2.1
GRN01
  Top 0.305: R59.1 U2.2
GRN02
  Top 0.305: R57.1 U2.3
GRN03
  Top 0.305: R55.1 U2.4
GRN04
  Top 0.305: R53.1 U2.5
GRN05
  Top 0.305: R51.1 U2.6
GRN06
  Top 0.305: R49.1 U2.7
GRN07
  Top 0.305: R47.1 U2.8
GRN08
  Top 0.305: R45.1 U2.9
GRN09
  Top 0.305: R43.1 U2.10
GRN10
  Top 0.305: R41.1 U2.11
GRN11
  Top 0.305: R39.1 U2.12
N$1  (via drill 0.51)
  Top 0.203: v109.86,25.02 111.63,23.24 111.63,6.99 IC2.1 | v106.68,28.19 IC1.1
  Bottom 0.203: v109.86,25.02 v106.68,28.19
N$2  (via drill 0.51)
  Top 0.203: v107.95,8.64 107.95,8.26 IC2.2 | v105.41,11.18 105.41,20.32 105.28,20.45 105.28,22.86 104.78,22.86 104.78,23.5 104.39,23.88 IC1.14
  Bottom 0.203: v105.41,11.18 v107.95,8.64
N$3  (via drill 0.51)
  Top 0.203: v107.95,10.03 107.95,9.53 IC2.3 | v100.46,17.53 100.46,23.24 IC1.11
  Bottom 0.203: v100.46,17.53 v107.95,10.03
N$4  (via drill 0.51)
  Top 0.203: v35.31,64.52 46.86,64.52 46.86,63.37 50.04,60.2 v58.93,60.2
  Bottom 0.203: v35.31,64.52 35.18,64.52 35.18,52.45 31.62,48.9 31.62,48.77 U2.26 | v58.93,60.2 63.75,55.37 63.75,51.82 67.94,51.82 71.37,48.39 71.37,47.24 83.69,47.24 89.28,41.66 108.58,41.66 108.97,41.27 108.97,38.99 108.71,38.73 107.7,38.73 U1.17
N$5  (via drill 0.51)
  Top 0.203: v32.77,30.99 32.77,25.65 31.88,25.65 U2.17
  Bottom 0.203: v32.77,30.99 32.77,41.78 38.99,41.78 42.04,44.83 44.83,44.83 45.21,45.21 45.59,45.21 45.59,72.52 61.85,72.52 70.87,63.5 70.87,56.13 72.26,56.13 U3.26
N$6  (via drill 0.51)
  Top 0.203: v58.93,12.95 v60.71,14.73 | v103,39.75 103,52.45 102.11,53.34 102.11,69.22 SHIELD2.D3-PWM
  Bottom 0.203: v58.93,12.95 57.66,12.95 55.75,14.86 50.67,14.86 47.75,17.78 42.29,17.78 33.27,26.8 31.62,26.8 31.62,27.43 U2.18 | v60.71,14.73 60.71,26.42 67.44,26.42 71.12,30.1 71.12,35.31 72.26,35.31 U3.18 75.06,35.81 88.65,35.81 92.46,39.62 103,39.62 | 103,39.62 105.54,39.62 105.54,40.13 U1.18 | 103,39.62 v103,39.75
N$7
  Top 0.305: Q9.8 Q9.7 80.14,62.87 79.63,63.37 79.63,65.02 77.47,67.18 59.05,67.18 53.09,73.15 34.42,73.15 32.26,70.99 32.26,66.27 X2.5
N$8  (via drill 0.51)
  Top 0.203: U1.23 108.08,53.59 109.35,53.59 109.35,55.88 111.25,57.78 111.25,59.69 JP1.1 | v75.95,63.5 75.95,48.51 75.06,48.51 U3.23
  Bottom 0.203: U2.23 31.62,41.15 31.62,41.27 39.24,48.9 39.24,61.72 42.55,61.72 45.09,64.26 45.09,73.03 78.87,73.03 81.03,70.87 81.03,70.74 82.04,70.74 SHIELD2.D10-PWM 82.04,69.22 81.28,69.22 81.28,68.83 v75.95,63.5 | U1.23 105.54,53.85 105.54,54.36 81.66,54.36 75.82,48.51 75.06,48.51 U3.23
N$9  (via drill 0.51)
  Top 0.203: v82.55,66.55 80.64,68.45 80.52,68.45 80.52,69.47 SHIELD2.D11-PWM
  Bottom 0.203: v82.55,66.55 87.12,61.98 105.54,61.98 105.54,61.47 U1.26
N$10  (via drill 0.51)
  Top 0.203: v71.25,74.42 74.42,71.25 74.42,70.48 SHIELD2.D13
  Bottom 0.203: v71.25,74.42 36.58,74.42 36.58,65.02 37.47,65.02 37.47,52.2 31.62,46.35 31.62,46.23 U2.25 | 75.95,57.4 75.95,59.94 71.75,59.94 71.37,60.33 71.37,68.33 72.9,68.33 73.41,68.83 73.41,68.96 74.42,68.96 SHIELD2.D13 | 75.95,57.4 75.95,55.12 75.31,54.48 74.8,54.48 74.8,53.85 U3.25 | 75.95,57.4 105.54,57.4 105.54,57.91 U1.25
N$11
  Top 0.203: IC1.13 102.87,27.3 | 102.87,27.3 IC1.4 | 102.87,27.3 107.06,27.3 108.97,29.21 108.97,35.18 113.16,39.37 113.16,52.83 113.92,52.83 113.92,62.48 113.16,62.48 JP1.2
N$12  (via drill 0.51)
  Top 0.203: v101.35,52.83 101.35,66.67 99.95,68.07 89.03,68.07 89.03,70.61 88.01,71.63 77.47,71.63 77.47,70.74 SHIELD2.D12 | IC1.2 v105.41,28.57
  Bottom 0.203: v105.41,28.57 109.35,32.51 109.35,38.73 109.47,38.86 109.47,49.28 104.9,49.28 v101.35,52.83
N$13
  Top 0.203: IC1.3 104.39,31.37 104.39,67.94 105.28,68.83 105.28,71.12 104.27,72.14 91.69,72.14 91.69,70.48 SHIELD2.D7
N$14  (via drill 0.51)
  Top 0.203: U1.24 108.08,56.13 108.97,56.13 108.97,63.25 109.98,64.26 110.36,64.26 110.36,65.02 JP1.3 | v72.39,62.61 71.37,61.59 71.37,51.05 72.26,51.05 U3.24
  Bottom 0.203: U2.24 31.62,43.69 31.62,43.81 37.97,50.16 37.97,65.02 38.86,65.02 38.86,73.53 81.15,73.53 83.82,70.87 83.82,70.48 84.58,70.48 SHIELD2.D9-PWM 84.58,68.96 83.57,68.96 83.57,68.83 83.5,68.77 | v72.39,62.61 77.34,62.61 83.5,68.77 | JP1.3 111.25,66.04 111.25,68.07 84.2,68.07 83.5,68.77
N$15  (via drill 0.51)
  Top 0.203: v38.73,19.94 38.73,20.32 42.29,20.32 42.55,20.57 42.55,21.34 42.8,21.59 43.81,21.59 44.07,21.84 44.07,30.86 43.43,31.5 42.16,31.5 IC3.1 | v46.99,16.89 46.99,9.91 v47.75,9.14 | v98.81,5.21 101.85,8.26 IC2.15
  Bottom 0.203: v38.73,19.94 41.4,17.27 46.61,17.27 v46.99,16.89 | v47.75,9.14 51.69,5.21 v98.81,5.21
N$16  (via drill 0.51)
  Top 0.203: v96.65,4.32 101.22,8.89 101.22,9.53 IC2.14 | v28.57,21.84 28.19,22.23 28.19,38.73 28.57,39.12 33.66,39.12 33.66,38.73 38.61,38.73 38.61,35.94 38.48,35.81 38.48,35.05 39.24,34.29 IC3.3
  Bottom 0.203: v96.65,4.32 96.27,4.7 50.93,4.7 44.83,10.79 44.83,15.37 40.39,15.37 33.91,21.84 v28.57,21.84
N$17  (via drill 0.51)
  Top 0.203: v43.05,34.54 43.05,36.83 IC3.5 | v48.9,18.54 47.88,17.53 v47.88,15.88 | v46.1,16 45.21,15.11 v45.21,9.14 | v94.87,3.81 101.85,10.79 IC2.13
  Bottom 0.203: v43.05,34.54 43.05,31.62 41.27,29.84 41.27,24.89 41.91,24.26 44.96,24.26 45.72,23.5 45.72,19.56 46.35,18.92 48.9,18.92 v48.9,18.54 | v47.88,15.88 47.75,16 v46.1,16 | v45.21,9.14 45.21,4.57 49.66,4.57 50.42,3.81 v94.87,3.81
N$18  (via drill 0.51)
  Top 0.203: v32.51,24.38 28.7,24.38 28.7,37.08 32.38,37.08 32.77,37.47 32.77,38.1 IC3.9 | v37.47,20.19 37.47,17.78 v37.08,17.4 | v44.7,3.81 93.98,3.81 93.98,4.19 101.85,12.06 IC2.12
  Bottom 0.203: v32.51,24.38 33.02,23.88 33.78,23.88 v37.47,20.19 | v37.08,17.4 40.01,14.48 41.15,14.48 41.66,13.97 41.66,11.18 42.93,11.18 44.32,9.78 44.32,3.81 v44.7,3.81
N$19  (via drill 0.51)
  Top 0.203: v36.83,35.18 36.83,35.56 IC3.11 | v33.66,29.08 33.4,28.83 v33.4,22.99 | v61.47,6.1 62.36,5.21 94.36,5.21 94.36,5.84 101.85,13.34 IC2.11
  Bottom 0.203: v36.83,35.18 33.66,32 v33.66,29.08 | v33.4,22.99 39.62,16.76 44.07,16.76 46.74,14.1 48.39,14.1 48.39,14.22 48.51,14.35 53.21,14.35 v61.47,6.1
N$20  (via drill 0.51)
  Top 0.203: v72.01,34.16 70.87,35.31 70.87,62.48 64.64,62.48 61.85,59.69 61.85,59.31 53.59,59.31 50.8,56.52 50.8,56.39 49.91,56.39 49.91,38.86 47.12,38.86 45.59,37.34 45.59,33.66 38.99,33.66 38.48,33.15 38.48,33.02 IC3.13 | v87.25,27.43 91.57,23.11 94.87,23.11 94.87,21.08 101.35,14.61 IC2.10
  Bottom 0.203: v72.01,34.16 72.01,34.04 76.96,34.04 83.57,27.43 v87.25,27.43
N$21
  Top 0.203: 41.91,23.5 Q1.4 40.01,23.75 40.01,24.64 38.35,24.64 37.72,25.27 | 37.72,25.27 36.83,25.27 R1.2 | 37.72,25.27 37.72,26.16 R7.1
N$22
  Top 0.203: R8.1 39.12,29.34 38.73,28.96 38.73,28.32 36.83,28.32 R2.2 36.2,27.43 36.2,26.54 35.56,26.54 35.56,24.26 37.34,24.26 37.97,23.62 37.97,20.95 Q1.2
N$23
  Top 0.203: R9.1 34.8,43.56 35.69,43.56 35.69,44.58 35.81,44.58 35.81,44.7 37.97,44.7 37.97,44.32 R3.2 38.29,44.32 38.29,49.53 Q2.4
N$24
  Top 0.203: R4.2 38.73,41.78 39.75,41.78 39.75,43.05 40.13,43.05 R10.1 39.81,43.56 39.12,44.7 38.73,44.7 38.73,46.99 Q2.2
N$25
  Top 0.203: R5.2 43.69,49.53 43.94,49.53 43.94,55.24 Q3.4 41.27,55.5 41.27,56.64 R11.1
N$26  (via drill 0.51)
  Top 0.203: v44.45,45.72 43.69,45.72 R6.2 | Q3.2 v40.13,52.7 39.88,53.09 38.73,54.23 38.73,56.64 R93.1
  Bottom 0.203: v44.45,45.72 40.13,50.04 v40.13,52.7
N$27
  Top 0.203: R15.2 94.23,37.59 94.23,36.7 92.71,36.7 R16.2 92.2,36.32 92.2,34.8 89.92,32.51 89.92,31.11 Q4.2
N$28
  Bottom 0.203: R12.2 71.12,40.89 72.26,40.89 U3.20
N$29
  Bottom 0.203: R13.2 28.45,32.89 29.08,32.89 U2.20
N$30  (via drill 0.51)
  Top 0.203: v34.67,26.67 34.67,25.91 R1.1 | v39.37,32.77 40.26,32.77 IC3.2
  Bottom 0.203: v34.67,26.67 34.67,29.72 34.92,29.72 37.97,32.77 v39.37,32.77
N$31  (via drill 0.51)
  Top 0.203: v34.54,30.61 34.54,28.45 R2.1 | v39.37,35.43 40.26,35.43 IC3.4
  Bottom 0.203: v34.54,30.61 v39.37,35.43
N$32
  Top 0.203: R3.1 37.08,43.31 37.47,43.31 37.47,40.01 38.23,39.24 39.24,39.24 39.24,38.23 39.37,38.1 IC3.6
N$33
  Top 0.203: R4.1 36.2,40.77 35.69,40.77 35.69,39.62 IC3.8
N$34  (via drill 0.51)
  Top 0.203: v41.91,43.43 42.04,43.43 42.04,45.21 42.16,45.21 42.16,46.99 42.67,46.99 R5.1 | IC3.10 v36.83,36.83
  Bottom 0.203: v41.91,43.43 36.83,38.35 v36.83,36.83
N$35  (via drill 0.51)
  Top 0.203: v42.93,42.29 42.93,43.18 R6.1 | v37.72,37.72 37.72,34.8 37.21,34.29 IC3.12
  Bottom 0.203: v42.93,42.29 38.35,37.72 v37.72,37.72
N$36
  Bottom 0.203: R14.2 104.14,45.97 105.28,45.97 U1.20
N$37  (via drill 0.51)
  Top 0.203: R25.2 94.23,50.29 94.23,49.66 92.71,49.66 R26.2 92.2,49.02 v92.2,48.26 | Q6.4 v89.28,46.35
  Bottom 0.203: v89.28,46.35 91.19,48.26 v92.2,48.26
N$38
  Top 0.203: R17.2 94.23,40.13 94.23,39.5 92.71,39.5 R18.2 92.2,38.86 92.2,37.97 91.44,37.97 91.44,35.56 90.42,34.54 90.42,33.66 Q4.4
N$39  (via drill 0.51)
  Top 0.203: R27.2 94.23,52.83 94.23,52.2 92.71,52.2 R28.2 92.2,51.56 v92.2,50.8 | Q7.2 v89.28,50.16
  Bottom 0.203: v89.28,50.16 89.92,50.8 v92.2,50.8
N$40  (via drill 0.51)
  Top 0.203: R31.2 94.23,57.91 94.23,57.28 92.71,57.28 R32.2 92.2,56.64 v92.2,55.88 | Q8.2 v89.28,56.52
  Bottom 0.203: v89.28,56.52 89.92,55.88 v92.2,55.88
N$41  (via drill 0.51)
  Top 0.203: R29.2 94.23,55.37 94.23,54.74 92.71,54.74 R30.2 92.2,54.1 v92.2,53.34 | Q7.4 v89.28,52.7
  Bottom 0.203: v89.28,52.7 89.92,53.34 v92.2,53.34
N$42  (via drill 0.51)
  Top 0.203: R21.2 94.23,45.21 94.23,44.58 92.71,44.58 R22.2 92.2,43.94 v92.2,43.18 | v89.66,43.18 87.5,41.02 87.5,40.26 Q5.4
  Bottom 0.203: v89.66,43.18 v92.2,43.18
N$43  (via drill 0.51)
  Top 0.203: R19.2 94.23,42.67 94.23,42.04 92.71,42.04 R20.2 92.2,41.4 v92.2,40.64 | Q5.2 v89.03,37.47
  Bottom 0.203: v89.03,37.47 v92.2,40.64
N$44  (via drill 0.51)
  Top 0.203: R23.2 94.23,47.75 94.23,47.12 92.71,47.12 R24.2 92.2,46.48 v92.2,45.72 | Q6.2 v88.39,43.81
  Bottom 0.203: v88.39,43.81 90.3,45.72 v92.2,45.72
N$45  (via drill 0.51)
  Top 0.203: R33.2 94.23,60.45 94.23,59.82 92.71,59.82 R34.2 92.2,59.18 v92.2,58.42 | Q8.4 v89.28,59.05
  Bottom 0.203: v89.28,59.05 89.92,58.42 v92.2,58.42
N$46  (via drill 0.51)
  Top 0.203: R35.2 94.23,62.99 94.23,62.36 92.71,62.36 R36.2 92.2,62.74 v92.2,63.5 | Q9.2 v89.28,62.87
  Bottom 0.203: v89.28,62.87 89.92,63.5 v92.2,63.5
N$47
  Top 0.203: R37.2 94.23,65.53 94.23,64.9 92.71,64.9 R38.2 92.2,65.28 92.2,66.17 89.79,66.17 89.28,65.66 89.28,65.41 Q9.4
N$48
  Top 0.305: Q9.6 Q9.5 81.22,66.48 80.01,67.69 59.31,67.69 53.34,73.66 32.38,73.66 29.72,70.99 29.72,66.47 X2.6
N$49
  Top 0.305: Q8.6 Q8.5 80.77,59.05 79.12,60.71 79.12,64.77 77.22,66.67 58.8,66.67 52.96,72.52 36.45,72.52 34.92,70.99 34.92,66.22 X2.4
N$50
  Top 0.305: Q8.8 Q8.7 79.12,56.52 78.61,57.02 78.61,64.52 76.96,66.17 58.55,66.17 52.83,71.88 38.73,71.88 37.72,70.87 X2.3
N$51
  Top 0.305: Q7.7 Q7.8 81.22,50.1 81.15,50.16 79.38,50.16 77.6,51.94 77.6,64.01 76.45,65.15 57.78,65.15 52.2,70.74 44.32,70.74 43.31,69.72 43.31,66.27 X2.1
N$52
  Top 0.305: Q6.7 Q6.8 81.22,42.23 79.12,40.13 79.12,35.56 78.23,34.67 78.23,28.7 75.06,25.53 61.09,25.53 53.34,17.78 53.34,9.53 52.07,8.26 41.27,8.26 40.39,9.14 40.39,12.78 X1.2
N$53
  Top 0.305: Q7.6 Q7.5 79.12,52.7 78.11,53.72 78.11,64.26 76.71,65.66 58.17,65.66 52.58,71.25 41.78,71.25 40.39,69.85 40.39,66.27 X2.2
N$54
  Top 0.305: Q6.5 Q6.6 80.01,45.09 78.49,43.56 78.49,35.69 77.72,34.92 77.72,29.08 74.68,26.04 60.71,26.04 54.61,19.94 48.77,19.94 43.18,14.35 43.18,12.9 X1.1
N$55
  Top 0.305: Q5.5 Q5.6 80.01,38.73 79.76,38.48 79.76,35.43 78.74,34.42 78.74,28.45 75.31,25.02 61.34,25.02 53.98,17.53 53.98,9.27 52.45,7.75 38.86,7.75 37.72,8.89 X1.3
N$56
  Top 0.305: Q5.7 Q5.8 81.22,36.13 79.25,34.16 79.25,28.19 75.56,24.51 61.59,24.51 54.61,17.4 54.61,9.14 52.7,7.24 36.7,7.24 34.92,9.02 34.92,12.83 X1.4
N$57
  Top 0.305: Q4.5 Q4.6 80.26,32.38 79.76,31.88 79.76,27.94 75.82,24 61.85,24 55.24,17.27 55.24,8.89 53.09,6.73 34.04,6.73 32.13,8.64 32.13,12.8 X1.5
N$58
  Top 0.305: Q4.7 Q4.8 81.22,28.64 76.07,23.5 62.23,23.5 55.88,17.14 55.88,8.76 53.21,6.1 32.13,6.1 29.46,8.76 29.46,12.83 X1.6
N$59
  Top 0.305: Q10.2 10.35,21.08 11.18,21.08 12.19,22.1 12.19,23.88 13.72,25.4 R39.2 16.93,24.13 R40.2
N$60
  Top 0.305: Q10.4 10.35,23.62 10.92,23.62 12.06,24.77 12.06,26.54 13.46,27.94 R41.2 16.93,26.67 R42.2
N$61
  Top 0.305: Q11.4 10.35,29.72 11.43,29.72 11.94,30.23 11.94,31.88 13.08,33.02 R45.2 16.93,31.75 R46.2
N$62
  Top 0.305: Q11.2 10.35,27.43 11.43,27.43 11.94,27.94 11.94,29.46 12.95,30.48 R43.2 16.93,29.21 R44.2
N$63
  Top 0.305: Q12.2 10.35,33.78 12.19,33.78 13.97,35.56 R47.2 16.93,34.29 R48.2
N$64
  Top 0.305: Q12.4 12.12,38.1 R49.2 16.93,36.83 R50.2
N$65
  Top 0.305: Q13.2 11.18,40.13 11.68,40.64 R51.2 16.93,39.37 R52.2
N$66
  Top 0.305: Q14.2 10.35,46.48 12.45,46.48 13.21,45.72 R55.2 16.93,44.45 R56.2
N$67
  Top 0.305: Q13.4 10.86,43.18 R53.2 16.93,41.91 R54.2
N$68
  Top 0.305: Q14.4 10.35,49.02 12.45,49.02 13.21,48.26 R57.2 16.93,46.99 R58.2
N$69
  Top 0.305: Q15.2 10.35,52.58 11.94,52.58 13.72,50.8 R59.2 16.93,49.53 R60.2
N$70
  Top 0.305: Q15.4 10.35,55.12 14.99,55.12 16.76,53.34 R61.2 16.93,52.07 R62.2
N$71
  Top 0.305: Q15.8 Q15.7 3.94,52.7 3.56,53.09 3.56,57.4 5.59,59.44 22.61,59.44 23.88,60.71 23.88,66.17 X2.8
N$72
  Top 0.305: Q15.6 Q15.5 5.02,57.85 6.1,58.93 24.89,58.93 26.67,60.71 X2.7
N$73
  Top 0.305: Q14.6 Q14.5 3.43,48.9 3.05,49.28 3.05,57.91 5.08,59.94 19.56,59.94 21.08,61.47 21.08,66.12 X2.9
N$74
  Top 0.305: Q14.8 Q14.7 3.17,46.35 2.54,46.99 2.54,58.42 4.57,60.45 16.51,60.45 18.29,62.23 18.29,66.09 X2.10
N$75
  Top 0.305: Q13.8 Q13.7 2.16,40.01 1.52,40.64 1.52,59.44 3.56,61.47 11.68,61.47 12.95,62.74 12.95,66.12 X2.12
N$76
  Top 0.305: Q12.7 Q12.8 3.17,32.38 2.03,31.24 2.03,17.27 4.57,14.73 13.97,14.73 15.75,12.95 15.75,12.98 X1.11
N$77
  Top 0.305: Q13.6 Q13.5 2.92,42.55 2.03,43.43 2.03,58.93 4.06,60.96 14.48,60.96 15.75,62.23 15.75,66.06 X2.11
N$78
  Top 0.305: Q12.5 Q12.6 3.17,34.92 1.52,33.27 1.52,17.02 4.32,14.22 11.43,14.22 12.7,12.95 12.7,13.03 X1.12
N$79
  Top 0.305: Q11.5 Q11.6 3.17,28.57 2.54,27.94 2.54,17.53 4.83,15.24 16.51,15.24 18.54,13.21 18.54,13.01 X1.10
N$80
  Top 0.305: Q11.7 Q11.8 3.68,26.04 3.05,25.4 3.05,17.78 5.08,15.75 20.07,15.75 21.34,14.22 21.34,13.03 X1.9
N$81
  Top 0.305: Q10.5 Q10.6 3.94,22.23 3.56,21.84 3.56,18.03 5.33,16.26 21.84,16.26 23.62,14.48 23.62,13.13 X1.8
N$82
  Top 0.305: Q10.7 Q10.8 5.02,18.09 6.35,16.76 24.38,16.76 26.42,14.73 26.42,13.11 X1.7
N$83
  Top 0.203: Q16.2 54.61,22.23 54.99,22.61 54.99,23.88 57.15,26.04 57.15,27.3 57.66,27.81 60.33,27.81 61.38,28.87 R63.2 60.11,29.21 R64.2
N$84
  Top 0.203: Q16.4 55.24,24.77 56.64,26.16 56.64,32.38 57.28,33.02 R65.2 60.11,31.75 R66.2
N$85
  Top 0.203: Q17.4 54.86,32.33 54.86,34.54 55.37,35.05 55.37,37.08 56.39,38.1 R69.2 60.11,36.83 R70.2
N$86
  Top 0.203: Q17.2 54.74,28.57 55.37,29.21 55.37,33.78 57.15,35.56 R67.2 60.11,34.29 R68.2
N$87
  Top 0.203: Q18.2 54.61,34.92 54.86,35.18 54.86,38.48 56.26,40.64 R71.2 60.11,39.37 R72.2
N$88
  Top 0.203: Q18.4 55.37,40.33 55.37,42.55 56.01,43.18 R73.2 60.11,41.91 R74.2
N$89
  Top 0.203: Q19.2 54.48,41.27 54.86,41.66 54.86,44.58 56.01,45.72 R75.2 60.11,44.45 R76.2
N$90
  Top 0.203: Q20.2 54.74,47.62 54.99,47.88 54.99,49.53 56.26,50.8 R79.2 60.11,49.53 R80.2
N$91
  Top 0.203: Q19.4 54.99,45.41 54.99,46.99 56.26,48.26 R77.2 60.11,46.99 R78.2
N$92
  Top 0.203: Q20.4 53.47,50.16 56.7,53.34 R81.2 60.11,52.07 R82.2
N$93
  Top 0.203: Q21.2 54.61,53.98 56.52,55.88 R83.2 60.11,54.61 R84.2
N$94
  Top 0.203: Q21.4 53.34,56.58 53.34,57.15 54.61,58.42 R85.2 60.11,57.15 R86.2
N$95
  Top 0.305: Q21.8 Q21.7 47.24,53.98 46.61,54.61 46.61,60.71 45.47,61.85 40.59,61.85 X2.15
N$96
  Top 0.305: Q21.6 Q21.5 48.2,60 44.7,63.5 42.01,63.5 X2.14
N$97
  Top 0.305: Q20.6 Q20.5 48.2,50.48 46.1,52.58 46.1,60.45 45.21,61.34 38.46,61.34 X2.16
N$98
  Top 0.305: Q20.8 Q20.7 47.37,47.62 45.59,49.4 45.59,60.2 44.96,60.83 35.97,60.83 X2.17
N$99
  Top 0.305: Q19.8 Q19.7 46.99,41.27 46.61,41.66 46.61,44.96 44.58,46.99 44.58,58.8 43.56,59.82 31.57,59.82 X2.19
N$100
  Top 0.305: Q18.7 Q18.8 48.2,32.71 47.37,31.88 46.99,31.88 45.09,29.97 45.09,20.19 40.89,16 32.38,16 30.86,14.48 30.86,10.06 X1.18
N$101
  Top 0.305: Q19.6 Q19.5 48.2,44.26 45.09,47.37 45.09,59.82 44.58,60.33 33.83,60.33 X2.18
N$102
  Top 0.305: Q18.5 Q18.6 47.12,36.2 46.61,35.69 46.61,32.26 44.58,30.23 44.58,20.45 40.64,16.51 29.59,16.51 28.07,14.99 28.07,10.03 X1.19
N$103
  Top 0.305: Q17.5 Q17.6 46.48,29.84 45.59,28.96 45.59,19.94 41.15,15.49 34.92,15.49 33.53,14.1 33.53,10.06 X1.17
N$104
  Top 0.305: Q17.7 Q17.8 48.2,27.25 46.1,25.15 46.1,19.68 41.4,14.99 37.47,14.99 36.32,13.84 X1.16
N$105
  Top 0.305: Q16.5 Q16.6 46.99,23.5 46.61,23.11 46.61,19.43 41.66,14.48 39.88,14.48 39.12,13.72 39.12,10.03 X1.15
N$106
  Top 0.305: X1.14 41.86,13.92 48.26,20.32 48.26,20.89 Q16.8 Q16.7
N$107
  Bottom 0.203: JP2.5 91.95,24.89 91.95,23.88 93.09,23.88 95,21.97 95.76,21.97 SHIELD2.ADC0
N$108
  Bottom 0.203: JP2.6 93.98,23.62 97.03,23.62 98.04,22.61 98.04,22.23 98.81,22.23 SHIELD2.ADC1
N$109
  Top 0.203: JP3.2 110.36,32.13 109.47,32.13 109.47,27.56 108.97,27.05 108.97,22.23 SHIELD2.ADC5
N$145  (via drill 0.51)
  Top 0.203: v100.71,34.29 100.84,34.16 100.84,31.37 100.58,31.37 IC1.6 | v103.5,37.08 103.89,37.47 103.89,67.56 102.74,68.71 102.74,70.87 101.98,71.63 94.23,71.63 94.23,70.74 SHIELD2.D6-PWM
  Bottom 0.203: v100.71,34.29 v103.5,37.08
RED00
  Top 0.203: R37.1 96.52,66.29 97.66,66.29 U1.1
RED01
  Top 0.203: R35.1 96.52,63.75 97.66,63.75 U1.2
RED02
  Top 0.203: R33.1 96.52,61.21 97.66,61.21 U1.3
RED03
  Top 0.203: R31.1 96.52,58.67 97.66,58.67 U1.4
RED04
  Top 0.203: R29.1 96.52,56.13 97.66,56.13 U1.5
RED05
  Top 0.203: R27.1 96.52,53.59 97.66,53.59 U1.6
RED06
  Top 0.203: R25.1 96.52,51.05 97.66,51.05 U1.7
RED07
  Top 0.203: R23.1 96.52,48.51 97.66,48.51 U1.8
RED08
  Top 0.203: R21.1 96.52,45.97 97.66,45.97 U1.9
RED09
  Top 0.203: R19.1 96.52,43.43 97.66,43.43 U1.10
RED10
  Top 0.203: R17.1 96.52,40.89 97.66,40.89 U1.11
RED11
  Top 0.203: R15.1 96.52,38.35 97.66,38.35 U1.12
RET1  (via drill 0.6)
  Top 0.61: Q1.6 Q1.5 35.5,22.41 35.56,22.35 34.29,22.35 33.27,21.34 33.27,19.05 32.77,18.54 v27.69,18.54
  Bottom 0.61: X1.20 25.3,16.41 26.67,17.78 26.67,19.05 | 26.67,19.05 26.67,55.88 25.4,57.15 25.4,63.25 X2.20 | v27.69,18.54 27.18,18.54 26.67,19.05
RET2  (via drill 0.6)
  Top 0.61: Q1.8 Q1.7 35.5,18.23 34.54,17.27 25.15,17.27 v23.88,18.54
  Bottom 0.61: X2.21 22.53,58.75 25.4,55.88 25.4,19.3 24.64,18.54 | 24.64,18.54 22.48,16.38 22.48,10.08 X1.21 | 24.64,18.54 v23.88,18.54
RET3  (via drill 0.6)
  Top 0.61: Q2.6 Q2.5 34.29,49.53 33.66,50.16 33.66,54.74 32.26,56.13 20.95,56.13 20.57,55.88 v19.76,55.88
  Bottom 0.61: X1.22 v19.76,55.88 X2.22
RET4  (via drill 0.6)
  Top 0.61: Q2.8 Q2.7 33.27,46.99 32.64,47.62 32.64,54.1 31.62,55.12 22.1,55.12 21.72,54.74 18.16,54.74 v17.02,55.88
  Bottom 0.61: X2.23 v17.02,55.88 X1.23
RET5  (via drill 0.6)
  Top 0.61: Q3.6 Q3.5 35.94,55.24 33.27,57.91 v14.25,57.91
  Bottom 0.61: X2.24 v14.25,57.91 X1.24
RET6  (via drill 0.6)
  Top 0.61: Q3.8 Q3.7 35.05,52.7 34.67,53.09 34.67,55.12 32.77,57.02 15.37,57.02 15.11,56.77 11.61,56.77 v11.48,56.9
  Bottom 0.61: X2.25 v11.48,56.9 X1.25
VBLU  (via drill 0.5, 0.51, 0.6)
  Top 0.203: 57.66,30.61 57.66,31.24 R66.1 | 57.66,30.61 57.66,29.72 R64.1 | R86.1 57.15,56.9 55.37,56.9 55.37,55.75 55.12,55.5 54.48,55.5 Q21.3 | 57.66,30.61 58.93,30.61 v58.93,30.48 | v56.26,36.07 R70.1 | v56.26,38.99 56.55,39.37 R72.1 | 57.19,34.29 v56.26,33.4 57.15,34.29 57.19,34.29 | 57.19,34.29 R68.1 | R80.1 56.64,49.53 v56.26,49.15 | v56.13,46.86 57.44,46.86 R78.1 | R82.1 57.19,51.69 v56.26,51.69 | Q21.1 54.74,52.7 v55.63,53.59 55.63,53.72 56.52,54.61 R84.1 | v56.13,44.45 R76.1 | v56.26,41.91 R74.1
  Top 0.305: 50.8,55.24 Q21.3 | 50.8,52.7 Q21.1 | 50.8,48.9 Q20.3 | 50.8,46.35 Q20.1 | 50.8,42.55 Q19.3 | 50.8,40.01 Q19.1 | 50.8,36.2 Q18.3 | 50.8,33.66 Q18.1 | 50.8,29.84 Q17.3 | 50.8,27.3 Q17.1 | 50.8,23.5 Q16.3 | Q16.1 51.44,20.95 50.8,21.59 v50.8,22.86
  Top 1.016: v50.8,22.86 50.8,23.5 50.8,27.3 50.8,29.84 50.8,33.66 50.8,36.2 50.8,40.01 50.8,42.55 50.8,46.35 50.8,48.9 50.8,52.7 50.8,55.24
  Bottom 0.203: 56.07,17.59 56.39,17.91 59.31,17.91 59.31,30.1 v58.93,30.48 56.26,33.15 v56.26,33.4 v56.26,36.07 v56.26,38.99 | v55.63,53.59 56.26,53.09 v56.26,51.69 v56.26,49.15 56.26,46.99 v56.13,46.86 v56.13,44.45 56.13,42.04 v56.26,41.91
  Bottom 1.016: J1.3 61.78,11.87 56.07,17.59 v50.8,22.86
VCC  (via drill 0.51)
  Top 0.203: v102.11,48.01 101.6,47.5 IC1.5 101.35,29.72 100.97,29.72 100.97,28.57 100.33,27.94 JP2.4 JP2.3 | 107.12,12.51 107.95,13.34 IC2.6 | 107.12,12.51 107.06,12.45 107.06,6.99 IC2.16 | U2.21 31.62,35.05 31.62,34.42 32.13,34.42 32.77,33.78 32.77,32.26 33.27,31.75 IC3.14 35.69,31.5 v35.69,29.21 | v76.71,34.92 76.71,42.93 75.06,42.93 U3.21 | v56.9,14.99 59.82,17.91 83.57,17.91 83.57,20.95 SHIELD2.5V | v107.06,12.57 107.12,12.51 | v64.52,68.58 64.52,69.47 68.83,69.47 SHIELD2.AREF
  Bottom 0.203: v102.11,48.01 105.28,48.01 U1.21 | v76.71,34.92 83.19,28.45 89.53,28.45 | 89.53,28.45 90.93,28.45 JP2.3 | 87.82,26.73 89.53,28.45 | 87.82,26.73 84.71,23.62 84.07,23.62 84.07,22.48 SHIELD2.5V | v35.69,29.21 41.15,23.75 44.83,23.75 45.21,23.37 45.21,19.05 45.97,18.29 47.88,18.29 50.8,15.37 56.39,15.37 56.77,14.99 v56.9,14.99 | v107.06,12.57 99.82,19.81 95.38,19.81 91.31,23.88 90.68,23.88 87.82,26.73 | v64.52,68.58 57.53,61.59 57.53,51.82 59.18,51.82 64.26,46.74 68.2,46.74 71.5,43.43 72.26,43.43 U3.21
VGRN  (via drill 0.5, 0.6)
  Top 0.203: R62.1 13.97,52.07 12.06,53.98 Q15.3 | R60.1 13.97,49.53 12.06,51.44 Q15.1 | R58.1 12.7,46.99 12.06,47.62 Q14.3 | R56.1 12.7,44.45 12.06,45.09 Q14.1 | R54.1 12.7,41.91 12.06,41.27 Q13.3 | R52.1 12.7,39.37 12.06,38.73 Q13.1 | R50.1 13.34,36.83 12.7,36.2 12.7,35.56 12.06,34.92 Q12.3 | R48.1 13.59,34.29 11.68,32.38 Q12.1 10.16,32.33 | v13.08,31.75 R46.1 | R44.1 13.21,29.21 v12.95,28.96 | 14.39,23.5 14.39,22.01 12.06,19.68 Q10.1 | 14.39,23.5 R40.1 | R42.1 13.46,26.67 v12.95,26.16 | v13.21,22.73 13.63,22.73 14.39,23.5
  Top 0.406: 7.62,53.98 Q15.3 | 7.62,51.44 Q15.1 | 7.62,47.62 Q14.3 | 7.62,45.09 Q14.1 | 7.62,41.27 Q13.3 | 7.62,38.73 Q13.1 | 7.62,34.92 Q12.3 | 7.62,32.38 Q12.1 | 7.62,28.57 Q11.3 | 7.62,26.04 Q11.1 | 7.62,22.23 Q10.3 | v7.62,20.95 7.62,20.32 8.26,19.68 Q10.1
  Top 1.016: v7.62,20.95 7.62,22.23 7.62,26.04 7.62,28.57 7.62,32.38 7.62,34.92 7.62,38.73 7.62,41.27 7.62,45.09 7.62,47.62 7.62,51.44 7.62,53.98 | J1.2 59.88,16.07 57.15,13.34 57.15,8.26 53.98,5.08 10.16,5.08 v7.62,7.62
  Bottom 0.203: 12.95,31.62 v12.95,28.96 v12.95,26.16 | 12.95,31.62 v13.08,31.75 | 12.95,31.62 12.95,22.99 v13.21,22.73
  Bottom 1.016: v7.62,7.62 v7.62,20.95
VIN
  Top 0.203: SHIELD2.VIN 90.68,21.21 90.04,21.21 90.04,20.45 86.23,16.64 70.23,16.64 J1.6
VRED  (via drill 0.5)
  Top 0.203: R38.1 90.68,64.26 90.68,62.74 R36.1 90.68,61.72 90.68,60.2 R34.1 90.68,59.18 90.68,57.66 R32.1 90.68,56.64 90.68,55.12 R30.1 90.68,54.1 90.68,52.58 R28.1 90.68,51.56 90.68,50.04 R26.1 90.68,49.02 90.68,47.5 R24.1 90.68,46.48 90.68,44.96 R22.1 | R16.1 90.68,37.34 90.68,38.86 R18.1 90.68,39.88 90.68,41.4 R20.1 90.68,42.42 90.68,43.94 R22.1 | R22.1 90.17,44.96 87.5,44.96 Q6.3
  Top 0.305: 83.82,64.14 Q9.3 | 83.82,61.59 Q9.1 | 83.82,57.78 Q8.3 | 83.82,55.24 Q8.1 | 83.82,51.44 Q7.3 | 83.82,48.9 Q7.1 | 83.82,45.09 Q6.3 | 83.82,42.55 Q6.1 | 83.82,38.73 Q5.3 | 83.82,36.2 Q5.1 | 83.82,32.38 Q4.3 | 83.82,29.84 Q4.1
  Top 1.016: v83.82,24.77 83.82,29.84 83.82,32.38 83.82,36.2 83.82,38.73 83.82,42.55 83.82,45.09 83.82,48.9 83.82,51.44 83.82,55.24 83.82,57.78 83.82,61.59 83.82,64.14
  Bottom 1.016: J1.1 63.26,23.25 64.77,24.77 v83.82,24.77